# Altium schematic sheet Regulateurs.SchDoc
size A4; SheetNumber: 4; SheetTotal: 7
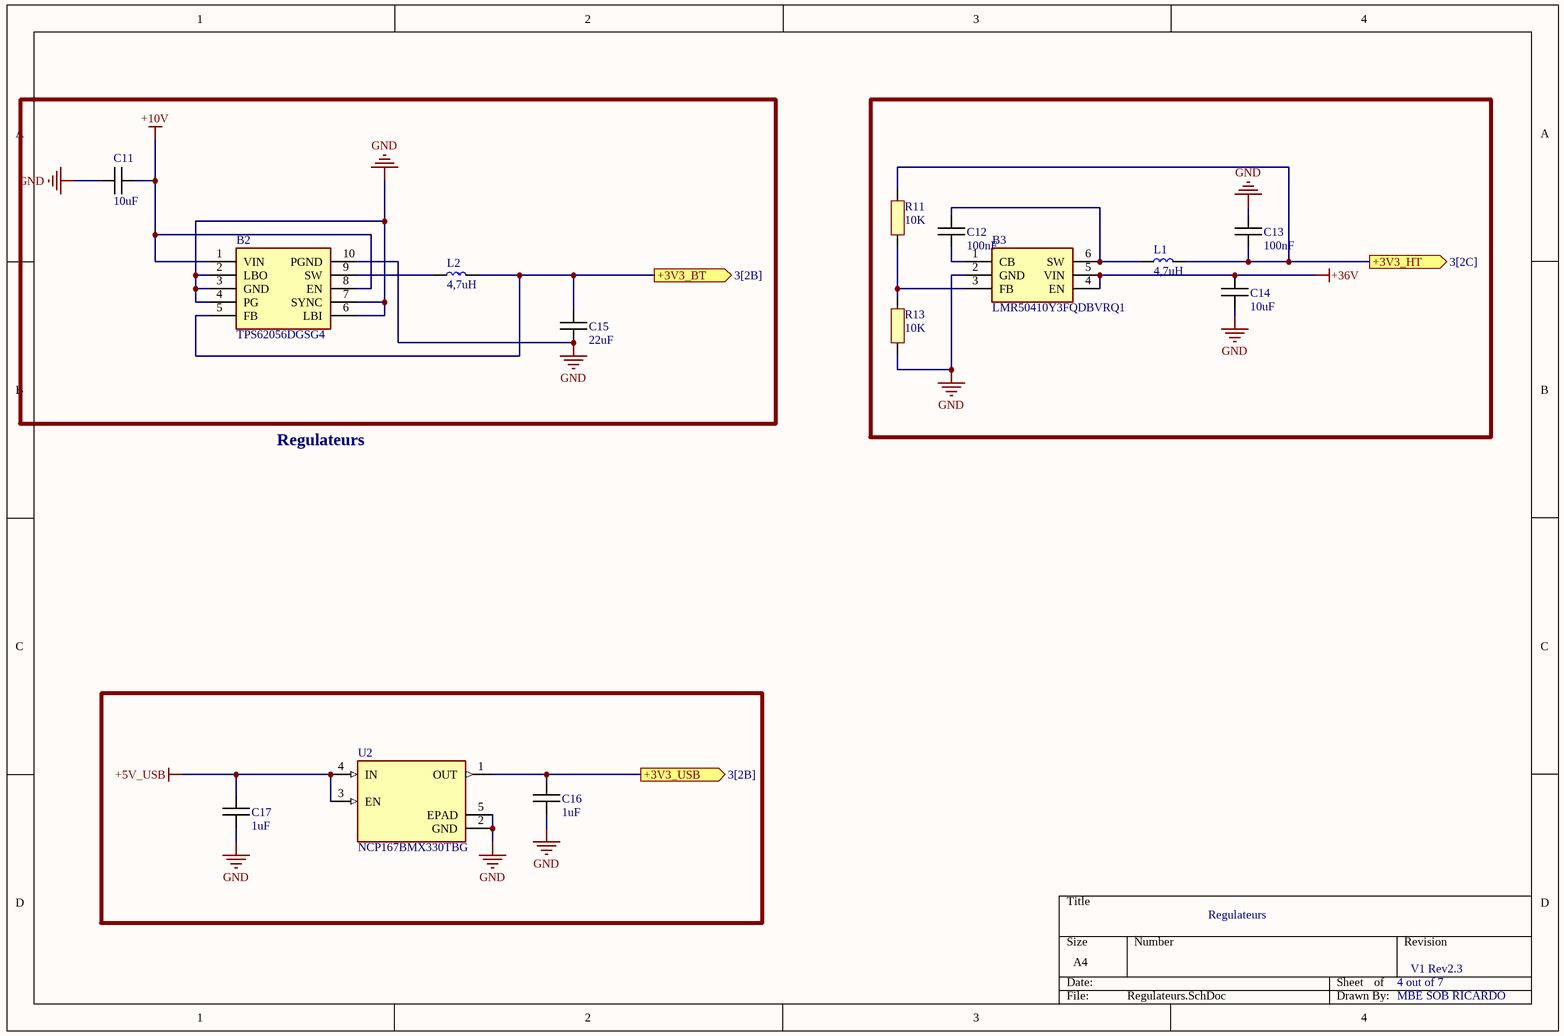
[diagram p0: Regulateurs.SchDoc]

## Parts
B2  TPS62056DGSG4  [SOP50P490X110-10N]
B3  LMR50410Y3FQDBVRQ1  [SOT95P280X145-6N]
C11  10uF  [CAPC1005X06N]
C12  100nF  [CAPC1005X06N]
C13  100nF  [CAPC1005X06N]
C14  10uF  [CAPC1005X06N]
C15  22uF  [CAPC1005X06N]
C16  1uF  [CAPC1005X06N]
C17  1uF  [CAPC1005X06N]
L1  4,7uH  [LQPC1005X06N]
L2  4,7uH  [LQPC1005X06N]
R11  10K  [RESC1005X06N]
R13  10K  [RESC1005X06N]
U2  NCP167BMX330TBG  [NCP167BMX330TBG]

## Ports
+3V3_BT (out, see 3[2B]), +3V3_HT (out, see 3[2C]), +3V3_USB (out, see 3[2B])

## Nets
+5V_USB: C17.2 U2.3(EN) U2.4(IN)
+10V: B2.1(VIN) B2.8(EN) C11.1
+36V: B3.4(EN) B3.5(VIN) C14.2
GND: B2.2(LBO) B2.3(GND) B2.4(PG) B2.6(LBI) B2.7(SYNC) B2.10(PGND) B3.2(GND) C11.2 C13.2 C14.1 C15.2 C16.1 C17.1 R13.1 U2.2(GND) U2.5(EPAD)
+3V3_BT: B2.5(FB) C15.1 L2.2 ; port +3V3_BT
+3V3_HT: C13.1 L1.2 R11.2 ; port +3V3_HT
+3V3_USB: C16.2 U2.1(OUT) ; port +3V3_USB
NetB2_9: B2.9(SW) L2.1
NetB3_1: B3.1(CB) C12.1
NetB3_3: B3.3(FB) R11.1 R13.2
NetB3_6: B3.6(SW) C12.2 L1.1

## Notes on the sheet
- Regulateurs
- 4 out of 7
- V1 Rev2.3
- MBE SOB RICARDO

## Library data of the parts
B2 = TPS62056DGSG4: TEXAS INSTRUMENTS - TPS62056DGSG4 - Synchronous Buck (Step Down) Switching Regulator, Fixed, 2.7V-10Vin, 3.3V/0.8A out, 850kHz, VSSOP-10; Manufacturer_Name: Texas Instruments; Manufacturer_Part_Number: TPS62056DGSG4; Mouser Part Number: 595-TPS62056DGSG4
B3 = LMR50410Y3FQDBVRQ1: Régulateurs de tension de commutation Automotive qualified SIMPLE SWITCHER 4-V to 36-V, 1-A synchronous step-down converter 6-SOT-23 -40 to 150; Manufacturer_Name: Texas Instruments; Manufacturer_Part_Number: LMR50410Y3FQDBVRQ1; Mouser Part Number: 595-R50410Y3FQDBVRQ1
C11-C17 = Capacitor
L1 L2 = Bobine
R11 R13 = Resistor
U2 = NCP167BMX330TBG: Régulateurs de tension LDO LDO 700 MA ULTRA-LOW NOISE 3.3V